# EAGLE design DIPThing (EAGLE 5.12)
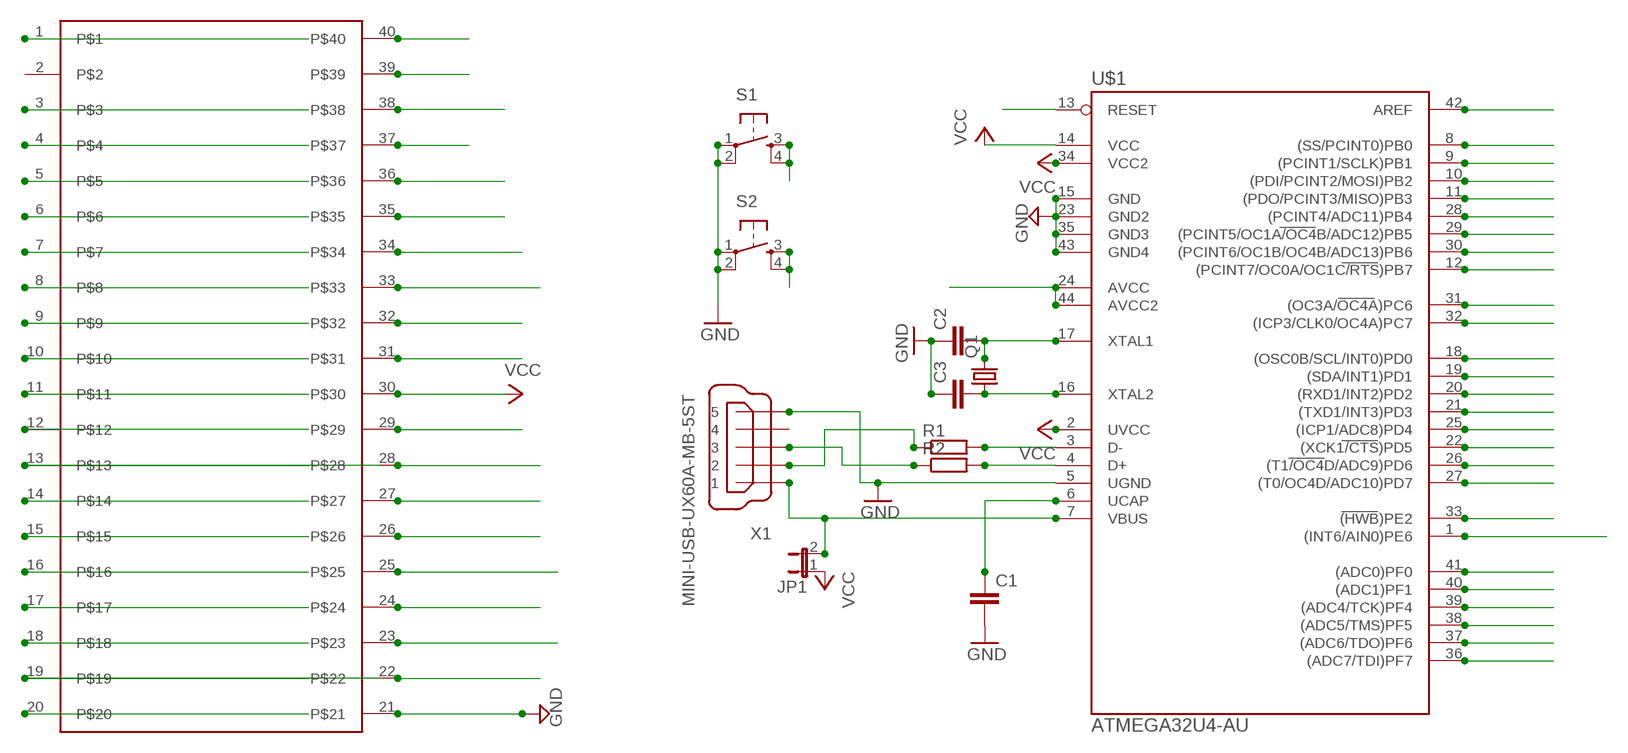
[diagram p0: schematic, sheet 1]

## Parts
C1  C2.5/2  [C2.5-2]
C2  C2,5-3  [C2.5-3]
C3  C2,5-3  [C2.5-3]
JP1  JP1E  [JP1]
Q1  CRYSTALHC18U-V  [HC18U-V]
R1  R-EU_M1206  [M1206]
R2  R-EU_M1206  [M1206]
S1  TAC_SWITCHPTH  [TACTILE-PTH]
S2  TAC_SWITCHPTH  [TACTILE-PTH]
U$1  ATMEGA32U4-AU  [TQFP44]
U$4  PDIP40  [DIP40]
X1  MINI-USB-UX60A-MB-5ST  [UX60A-MB-5ST]

## Nets
AREF: U$1.42(AREF) U$4.39
AVCC: U$1.24(AVCC) U$1.44(AVCC2) U$4.40
GND: C1.2 C2.1 C3.1 S1.1 S1.2 S2.1 S2.2 U$1.5(UGND) U$1.15(GND) U$1.23(GND2) U$1.35(GND3) U$1.43(GND4) U$4.21 X1.5
HWB: S1.3 S1.4 U$1.33((HWB)PE2) U$4.29
N$1: R2.1 X1.3
N$2: R1.1 X1.2
N$62: U$4.32
PB4: U$1.28((PCINT4/ADC11)PB4) U$4.25
PB5: U$1.29((PCINT5/OC1A/OC4B/ADC12)PB5) U$4.26
PB6: U$1.30((PCINT6/OC1B/OC4B/ADC13)PB6) U$4.27
PC6: U$1.31((OC3A/OC4A)PC6) U$4.31
PC7: U$1.32((ICP3/CLK0/OC4A)PC7) U$4.28
PD0: U$1.18((OSC0B/SCL/INT0)PD0) U$4.16
PD1: U$1.19((SDA/INT1)PD1) U$4.17
PD2: U$1.20((RXD1/INT2)PD2) U$4.18
PD3: U$1.21((TXD1/INT3)PD3) U$4.19
PD4: U$1.25((ICP1/ADC8)PD4) U$4.22
PD5: U$1.22((XCK1/CTS)PD5) U$4.20
PD6: U$1.26((T1/OC4D/ADC9)PD6) U$4.23
PD7: U$1.27((T0/OC4D/ADC10)PD7) U$4.24
PF0: U$1.41((ADC0)PF0) U$4.38
PF1: U$1.40((ADC1)PF1) U$4.37
PF4: U$1.39((ADC4/TCK)PF4) U$4.36
PF5: U$1.38((ADC5/TMS)PF5) U$4.35
PF6: U$1.37((ADC6/TDO)PF6) U$4.34
PF7: U$1.36((ADC7/TDI)PF7) U$4.33
PIN1: U$1.1((INT6/AIN0)PE6) U$4.1
PIN3: R1.2 U$1.3(D-) U$4.3
PIN4: R2.2 U$1.4(D+) U$4.4
PIN5: U$4.5
PIN6: C1.1 U$1.6(UCAP) U$4.6
PIN7: JP1.2 U$1.7(VBUS) U$4.7 X1.1
PIN8: U$1.8((SS/PCINT0)PB0) U$4.8
PIN9: U$1.9((PCINT1/SCLK)PB1) U$4.9
PIN10: U$1.10((PDI/PCINT2/MOSI)PB2) U$4.10
PIN11: U$1.11((PDO/PCINT3/MISO)PB3) U$4.11
PIN12: U$1.12((PCINT7/OC0A/OC1C/RTS)PB7) U$4.12
PIN13: S2.3 S2.4 U$1.13(RESET) U$4.13
VCC: JP1.1 U$1.2(UVCC) U$1.14(VCC) U$1.34(VCC2) U$4.30
XTAL1: C2.2 Q1.2 U$1.17(XTAL1) U$4.15
XTAL2: C3.2 Q1.1 U$1.16(XTAL2) U$4.14
Unconnected: U$4.2 X1.4

## Library data of the parts
C1-C3 = capacitor-wima:C: CAPACITOR naming: grid - package width
JP1 = jumper:JP1E: JUMPER
Q1 = crystal:CRYSTAL: CRYSTAL
R1 R2 = rcl:R-EU_: RESISTOR, European symbol
S1 S2 = SparkFun:TAC_SWITCH: Momentary Switch Button commonly used for reset or general input. Spark Fun Electronics SKU : COM-00097
U$1 = mega32U4:ATMEGA32U4-AU
U$4 = breandan:PDIP40
X1 = con-hirose:MINI-USB-: MINI USB Connector Source: http://www.hirose.co.jp/cataloge_hp/e24000019.pdf

## Board
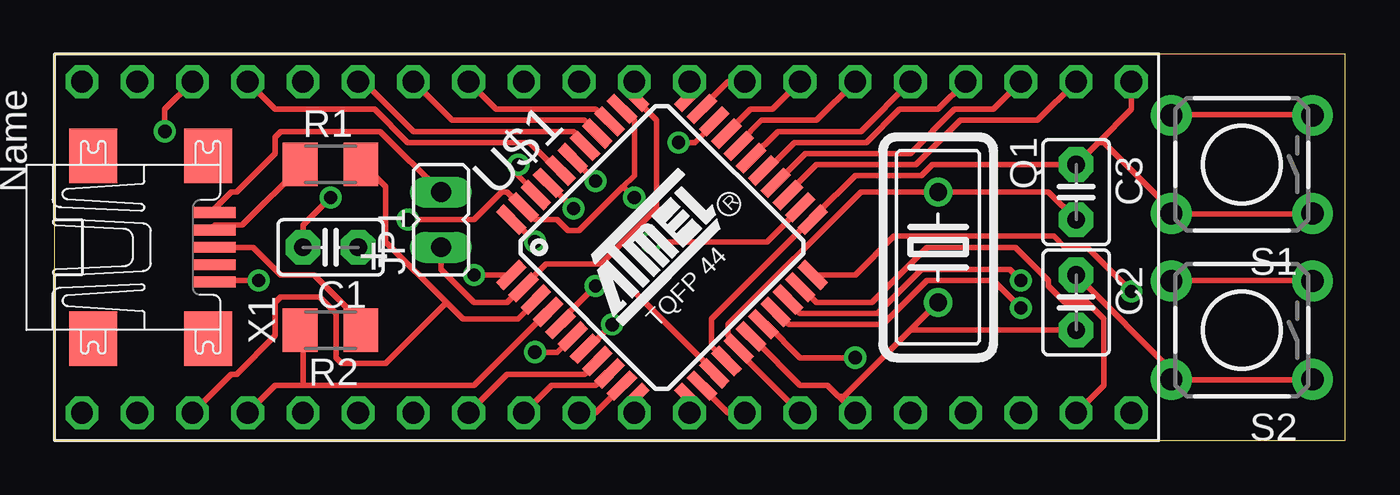
[diagram p1: board, top side]
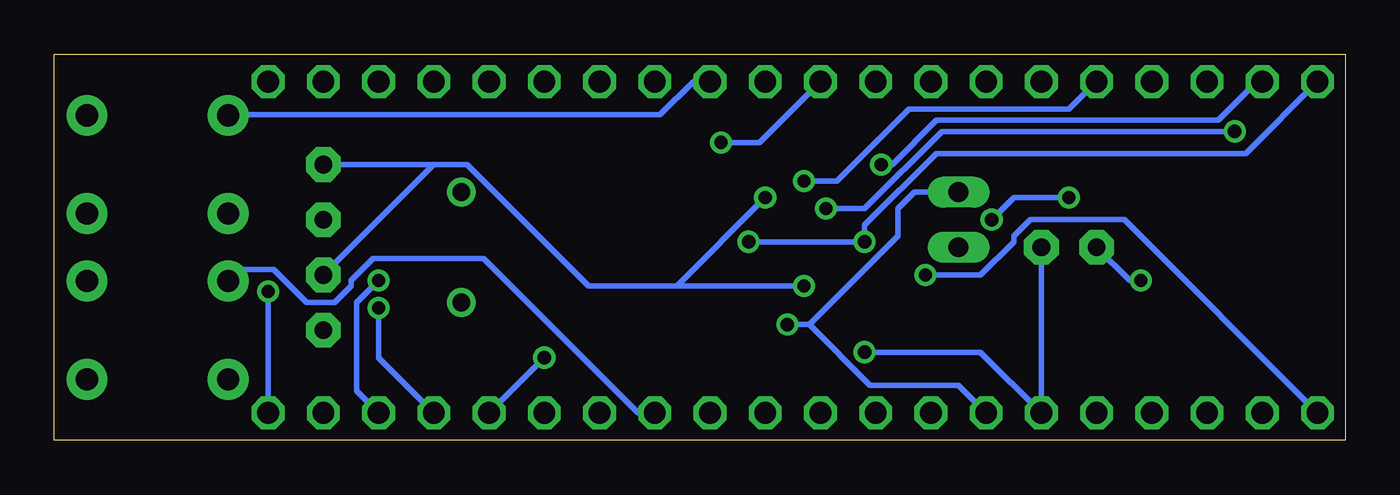
[diagram p2: board, bottom side, seen from below]

Size 59.36 x 17.77 mm. Coordinates in mm from the lower left corner, seen from the top.
Outline: 0,0 59.36,0 59.36,17.77 0,17.77 0,0
Copper layers (1*16): Top 0.035mm / dielectric 1.5mm / Bottom 0.035mm
Design rules "default": minimum track width 10mil, minimum drill 24mil, track to track 8mil, track to pad 8mil, pad to pad 8mil, via to via 8mil, smd to smd 8mil, copper to edge 40mil, drill to drill 8mil, minimum pad ring 10mil, minimum via ring 8mil, stop-mask expansion 4mil, vias tented up to drill 0mil, thermal gap 10mil

### Footprints (pad centres in the part's own frame; a part is rotated, then mirrored left to right if it is on the bottom)
C2.5-2 = drill 0.813 pad 1.6 octagon: 1 -1.27,0; 2 1.27,0
C2.5-3 = drill 0.813 pad 1.6 octagon: 1 -1.27,0; 2 1.27,0
JP1 = drill 0.914 long: 1 0,-1.27; 2 0,1.27
HC18U-V = drill 0.813 round: 1 -2.54,0; 2 2.54,0
M1206 = smd 1.6 x 2: 1 -1.4,0; 2 1.4,0
TACTILE-PTH = drill 1.016 pad 1.88 round: 1 -3.251,2.261; 2 3.251,2.261; 3 -3.251,-2.261; 4 3.251,-2.261
TQFP44 = smd 1.5 x 0.5: 1 -5.8,4; 2 -5.8,3.2; 3 -5.8,2.4; 4 -5.8,1.6; 5 -5.8,0.8; 6 -5.8,0; 7 -5.8,-0.8; 8 -5.8,-1.6; 9 -5.8,-2.4; 10 -5.8,-3.2; 11 -5.8,-4; 23 5.8,-4; 24 5.8,-3.2; 25 5.8,-2.4; 26 5.8,-1.6; 27 5.8,-0.8; 28 5.8,0; 29 5.8,0.8; 30 5.8,1.6; 31 5.8,2.4; 32 5.8,3.2; 33 5.8,4 | smd 0.5 x 1.5: 12 -4,-5.8; 13 -3.2,-5.8; 14 -2.4,-5.8; 15 -1.6,-5.8; 16 -0.8,-5.8; 17 0,-5.8; 18 0.8,-5.8; 19 1.6,-5.8; 20 2.4,-5.8; 21 3.2,-5.8; 22 4,-5.8; 34 4,5.8; 35 3.2,5.8; 36 2.4,5.8; 37 1.6,5.8; 38 0.8,5.8; 39 0,5.8; 40 -0.8,5.8; 41 -1.6,5.8; 42 -2.4,5.8; 43 -3.2,5.8; 44 -4,5.8
DIP40 = drill 1 octagon: 1 -7.62,25.4; 2 -7.62,22.86; 3 -7.62,20.32; 4 -7.62,17.78; 5 -7.62,15.24; 6 -7.62,12.7; 7 -7.62,10.16; 8 -7.62,7.62; 9 -7.62,5.08; 10 -7.62,2.54; 11 -7.62,0; 12 -7.62,-2.54; 13 -7.62,-5.08; 14 -7.62,-7.62; 15 -7.62,-10.16; 16 -7.62,-12.7; 17 -7.62,-15.24; 18 -7.62,-17.78; 19 -7.62,-20.32; 20 -7.62,-22.86; 21 7.62,-22.86; 22 7.62,-20.32; 23 7.62,-17.78; 24 7.62,-15.24; 25 7.62,-12.7; 26 7.62,-10.16; 27 7.62,-7.62; 28 7.62,-5.08; 29 7.62,-2.54; 30 7.62,0; 31 7.62,2.54; 32 7.62,5.08; 33 7.62,7.62; 34 7.62,10.16; 35 7.62,12.7; 36 7.62,15.24; 37 7.62,17.78; 38 7.62,20.32; 39 7.62,22.86; 40 7.62,25.4
UX60A-MB-5ST = smd 2 x 0.5: 1 2.25,1.6; 2 2.25,0.8; 3 2.25,0; 4 2.25,-0.8; 5 2.25,-1.6 | smd 2.2 x 2.5: M1 -3.3,-4.2; M2 -3.3,4.2; M3 2,4.2; M4 2,-4.2

### Placement (x,y rotation side)
C1  12.7,8.89 180 top
C2  46.99,6.35 270 top
C3  46.99,11.43 270 top
JP1  17.78,10.16 0 top
Q1  40.64,8.89 270 top
R1  12.7,12.7 0 top
R2  12.7,5.08 180 top
S1  54.61,12.7 180 top
S2  54.61,5.08 180 top
U$1  27.94,8.89 45 top
U$4  26.67,8.89 90 top
X1  5.08,8.89 0 top

### Tracks (layer width: path | path; a pad name or v marks a point on that pad's centre or on a via)
AREF  (via drill 0.61)
  Top 0.254: v21.34,12.7 21.34,12.19 22.1,11.43 U$1.42
  Bottom 0.254: v21.34,12.7 20.83,12.7 18.8,14.73 5.84,14.73 4.06,16.51 U$4.39
AVCC  (via drill 0.61)
  Top 0.254: v22.1,9.14 21.08,10.16 U$1.44 | v27.43,9.14 32.77,9.14 34.29,10.67 U$1.24
  Bottom 0.254: U$4.40 4.57,13.21 18.8,13.21 22.1,9.91 v22.1,9.14 v27.43,9.14
GND  (via drill 0.61)
  Top 0.254: v9.4,7.37 7.37,7.37 X1.5 | 26.16,11.68 26.67,12.19 26.67,14.73 26.16,15.24 U$1.35 | 26.16,11.68 24.13,9.65 23.62,9.65 23.11,10.16 22.1,10.16 21.59,10.67 U$1.43 21.34,10.92 20.83,11.43 20.57,11.43 19.3,10.16 v16.26,10.16 | C1.2 11.43,9.91 v12.7,11.18 | C2.1 51.56,3.05 S2.2 51.56,2.79 57.66,2.79 S2.1 | S1.1 57.66,10.41 51.56,10.41 S1.2 51.31,10.67 48.26,13.72 48.01,13.72 | U$1.15 30.73,3.81 30.23,4.32 30.23,5.59 34.8,10.16 U$1.23 35.05,10.41 36.83,12.19 39.88,12.19 40.39,12.7 C3.1 48.01,13.72 | v24.89,7.11 23.37,5.59 U$1.5 | U$4.21 49.53,15.24 48.01,13.72 | 26.16,11.68 v26.67,11.18
  Bottom 0.254: v9.4,7.37 9.91,7.37 C1.2 | v12.7,11.18 15.24,11.18 v16.26,10.16 | 30.73,7.11 34.8,7.11 40.39,12.7 41.91,12.7 | 30.73,7.11 v24.89,7.11 | 41.91,12.7 C3.1 | 41.91,12.7 C2.1 | v26.67,11.18 30.73,7.11
HWB
  Top 0.254: U$4.29 29.21,16 U$1.33 | S1.3 57.66,14.99 51.56,14.99 S1.4
  Bottom 0.254: U$4.29 29.97,16.51 31.5,14.99 51.31,14.99 S1.4
N$1
  Top 0.254: R2.1 13.97,5.08 13.97,5.59 11.94,7.62 10.41,7.62 9.14,8.89 X1.3
N$2
  Top 0.254: X1.2 7.37,9.91 8.64,9.91 11.43,12.7 R1.1
PB4
  Top 0.254: U$4.25 37.08,14.22 33.27,14.22 U$1.28
PB5
  Top 0.254: U$4.26 35.05,14.73 32.51,14.73 31.5,13.72 U$1.29
PB6
  Top 0.254: U$4.27 33.02,15.24 32,15.24 30.99,14.22 U$1.30
PC6  (via drill 0.61)
  Top 0.254: v28.7,13.72 29.46,13.72 30.23,14.48 U$1.31
  Bottom 0.254: v28.7,13.72 26.92,13.72 U$4.31
PC7
  Top 0.254: U$4.28 30.99,16.51 29.97,15.49 U$1.32
PD0  (via drill 0.61)
  Top 0.254: v36.83,3.81 34.29,3.81 32.77,5.33 U$1.18
  Bottom 0.254: v36.83,3.81 U$4.16
PD1  (via drill 0.61)
  Top 0.254: v44.45,6.1 43.18,7.37 40.13,7.37 38.1,5.33 33.78,5.33 33.27,5.84 U$1.19
  Bottom 0.254: v44.45,6.1 44.45,3.81 U$4.17
PD2  (via drill 0.61)
  Top 0.254: v44.45,7.37 43.94,7.87 39.88,7.87 37.85,5.84 34.29,5.84 33.78,6.35 U$1.20
  Bottom 0.254: v44.45,7.37 45.47,6.35 45.47,2.29 U$4.18
PD3
  Top 0.254: U$4.19 48.26,2.54 48.26,5.59 47.5,6.35 46.48,6.35 45.72,7.11 45.72,7.37 44.2,8.89 40.13,8.89 37.59,6.35 35.05,6.35 34.54,6.86 U$1.21
PD4
  Top 0.254: U$4.22 45.21,14.73 41.66,14.73 39.62,12.7 35.05,12.7 33.78,11.43 U$1.25
PD5  (via drill 0.61)
  Top 0.254: v49.53,6.86 47.5,8.89 46.48,8.89 45.97,9.4 38.61,9.4 36.83,7.62 35.05,7.62 U$1.22
  Bottom 0.254: v49.53,6.86 U$4.20
PD6
  Top 0.254: U$4.23 43.18,15.24 41.4,15.24 39.37,13.21 34.54,13.21 33.27,11.94 U$1.26
PD7
  Top 0.254: U$4.24 40.64,15.24 38.86,15.24 37.34,13.72 34.04,13.72 32.77,12.45 U$1.27
PF0  (via drill 0.61)
  Top 0.254: v23.88,10.67 22.86,11.68 U$1.41 | v5.08,14.22 5.08,15.24 U$4.38
  Bottom 0.254: v23.88,10.67 22.1,10.67 18.54,14.22 v5.08,14.22
PF1
  Top 0.254: U$4.37 10.16,15.24 14.73,15.24 16.26,13.72 21.84,13.72 23.11,12.45 U$1.40
PF4  (via drill 0.61)
  Top 0.254: v24.89,11.94 23.88,12.95 U$1.39
  Bottom 0.254: v24.89,11.94 23.37,11.94 20.07,15.24 12.7,15.24 U$4.36
PF5
  Top 0.254: U$4.35 14.22,16.51 16.51,14.22 23.88,14.22 24.38,13.72 U$1.38
PF6
  Top 0.254: U$4.34 18.29,14.73 24.38,14.73 24.89,14.22 U$1.37
PF7
  Top 0.254: U$4.33 20.32,15.24 24.89,15.24 25.4,14.73 U$1.36
PIN1  (via drill 0.61)
  Top 0.254: v19.3,7.62 20.83,7.62 U$1.1
  Bottom 0.254: v19.3,7.62 16.76,7.62 15.24,9.14 15.24,9.4 14.48,10.16 10.16,10.16 U$4.1
PIN3
  Top 0.254: 18.03,6.35 15.24,9.14 15.24,11.68 14.22,12.7 R1.2 | 18.03,6.35 18.8,5.59 21.34,5.59 22.1,6.35 U$1.3 | U$4.3 8.13,3.05 8.38,3.05 10.16,4.83 10.16,6.35 10.41,6.6 12.19,6.6 12.95,5.84 12.95,3.81 13.21,3.56 15.24,3.56 18.03,6.35
PIN4
  Top 0.254: 11.43,2.54 10.16,2.54 U$4.4 | 11.43,2.54 19.3,2.54 22.61,5.84 U$1.4 | 11.43,2.54 11.43,5.08 R2.2
PIN6  (via drill 0.61)
  Top 0.254: v22.1,4.06 23.11,4.06 U$1.6
  Bottom 0.254: v22.1,4.06 16.76,4.06 U$4.6 C1.1
PIN7  (via drill 0.61)
  Top 0.254: v25.65,5.33 24.64,4.32 U$1.7 | JP1.2 14.99,14.22 10.41,14.22 10.16,13.97 10.16,13.21 8.38,11.43 8.13,11.43 7.37,10.67 X1.1
  Bottom 0.254: 24.64,5.33 v25.65,5.33 | 24.64,5.33 21.84,2.54 17.78,2.54 U$4.7 | 24.64,5.33 20.57,9.4 20.57,10.67 19.81,11.43 JP1.2
PIN8
  Top 0.254: U$4.8 20.83,3.05 24.38,3.05 24.89,3.56 U$1.8
PIN9
  Top 0.254: U$4.9 22.86,2.54 24.89,2.54 25.4,3.05 U$1.9
PIN10
  Top 0.254: U$4.10 24.89,1.27 25.91,2.29 U$1.10
PIN11
  Top 0.254: U$4.11 26.67,1.78 U$1.11
PIN12
  Top 0.254: U$4.12 29.21,1.78 U$1.12
PIN13
  Top 0.254: U$4.13 30.99,1.27 29.97,2.29 U$1.13 | S2.3 57.66,7.37 51.56,7.37 S2.4
  Bottom 0.254: U$4.13 32.51,1.27 39.62,8.38 44.7,8.38 45.72,7.37 45.72,7.11 46.48,6.35 47.75,6.35 49.28,7.87 50.8,7.87 51.31,7.37 S2.4
VCC
  Top 0.254: U$4.30 26.67,16 U$1.34 26.67,15.75 27.69,14.73 27.69,10.67 25.15,8.13 | 25.15,8.13 22.61,8.13 21.59,7.11 U$1.2 21.34,6.86 20.83,6.35 19.3,6.35 17.78,7.87 JP1.1 | 25.15,8.13 25.4,8.13 30.23,3.3 U$1.14
XTAL1
  Top 0.254: 36.07,2.03 U$4.15 | 36.07,2.03 35.56,2.54 34.29,2.54 32.26,4.57 U$1.17 | 39.37,5.08 36.32,2.03 36.07,2.03 | 39.37,5.08 Q1.2 | 39.37,5.08 C2.2
XTAL2
  Top 0.254: U$4.14 31.5,4.06 U$1.16 31.24,4.32 31.24,4.57 30.99,4.83 30.99,5.33 37.08,11.43 Q1.1 45.72,11.43 C3.2

### Text on the board
tPlace: +